# EAGLE design CMC_PREAMP (EAGLE 9.1.2)
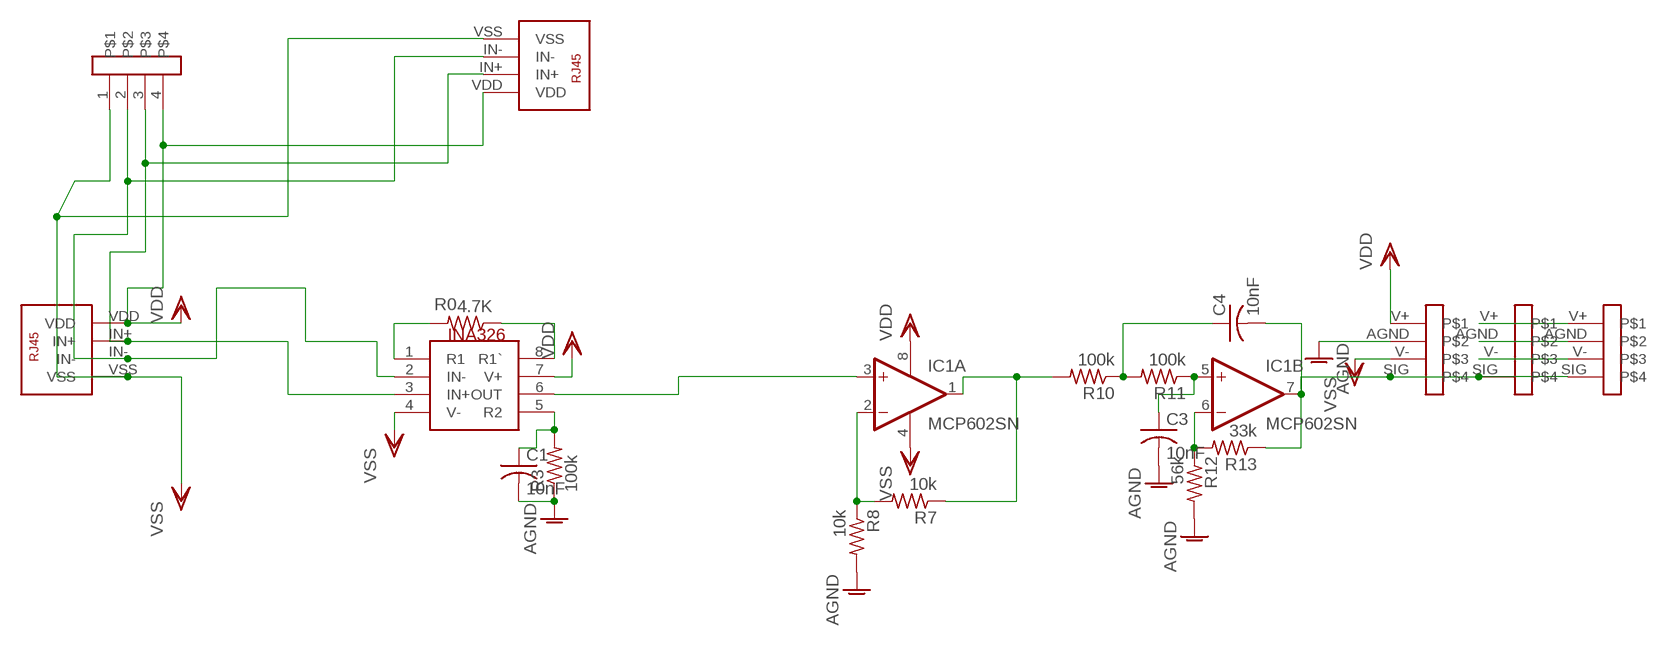
[diagram p0: schematic, sheet 1]

## Parts
C1  10nF  C-USC0603  [C0603]
C3  10nF  C-USC0603  [C0603]
C4  10nF  C-USC0603  [C0603]
IC1  MCP602SN  [SO08]
R0  4.7K  R-US_R0603  [R0603]
R3  100k  R-US_R0603  [R0603]
R7  10k  R-US_R0603  [R0603]
R8  10k  R-US_R0603  [R0603]
R10  100k  R-US_R0603  [R0603]
R11  100k  R-US_R0603  [R0603]
R12  56k  R-US_R0603  [R0603]
R13  33k  R-US_R0603  [R0603]
U$1  CON-4PIN_SILHOLE  [CON-4PIN-SIL]
U$2  CON-4PIN_SIL  [CONN-4PINSIL2]
U$3  CON-4PIN_SIL  [CONN-4PINSIL2]
U$4  RJ45-PRESSUREHOLE  [RJ45]
U$6  RJ45-PRESSUREHOLE  [RJ45]
U$7  CON-4PIN_SIL  [CONN-4PINSIL2]
U$8  INA326  [MSOP08]

## Nets
AGND: C1.2 C3.2 R3.1 R8.2 R12.2 U$7.AGND
AMP2-OUT: IC1.1(A:OUT) R7.1 R10.2
AMP-IN+: U$1.3 U$4.IN+ U$6.IN+ U$8.3(IN+)
AMP-IN-: U$1.2 U$4.IN- U$6.IN- U$8.2(IN-)
INA-OUT1: IC1.3(A:+IN) U$8.6(OUT)
LPF-OUT: C4.2 IC1.7(B:OUT) R13.1 U$2.SIG U$3.SIG U$7.SIG
N$1: R0.2 U$8.1(R1)
N$2: U$2.V+ U$3.V+
N$3: R0.1 U$8.8(R1`)
N$4: U$2.AGND U$3.AGND
N$6: U$2.V- U$3.V-
N$14: IC1.2(A:-IN) R7.2 R8.1
N$27: C4.1 R10.1 R11.2
N$28: C1.1 R3.2 U$8.5(R2)
N$32: IC1.6(B:-IN) R12.1 R13.2
N$33: C3.1 IC1.5(B:+IN) R11.1
VDD: IC1.8(P:V+) U$1.4 U$4.VDD U$6.VDD U$7.V+ U$8.7(V+)
VSS: IC1.4(P:V-) U$1.1 U$4.VSS U$6.VSS U$7.V- U$8.4(V-)

## Library data of the parts
C1 C3 C4 = rcl:C-US: CAPACITOR, American symbol
IC1 = linear:MCP602: Single Op Amp 2.7V to 6.0V Single Supply CMOS Source: http://ww1.microchip.com/downloads/en/DeviceDoc/21314g.pdf
R0 R3 R7 R8 R10-R13 = rcl:R-US_: RESISTOR, American symbol
U$1-U$3 U$7 = CMCbioengg:CON-4PIN_SIL
U$4 U$6 = CMCbioengg:RJ45-PRESSURE
U$8 = surdev_2014:INA326

## Board
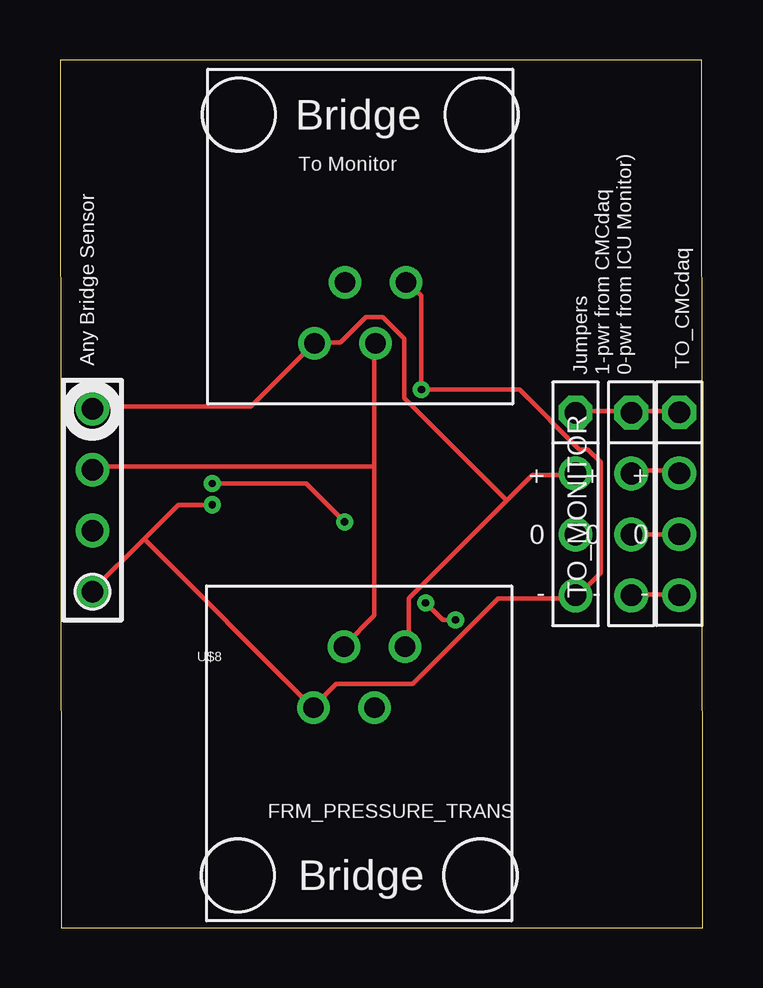
[diagram p1: board, top side]
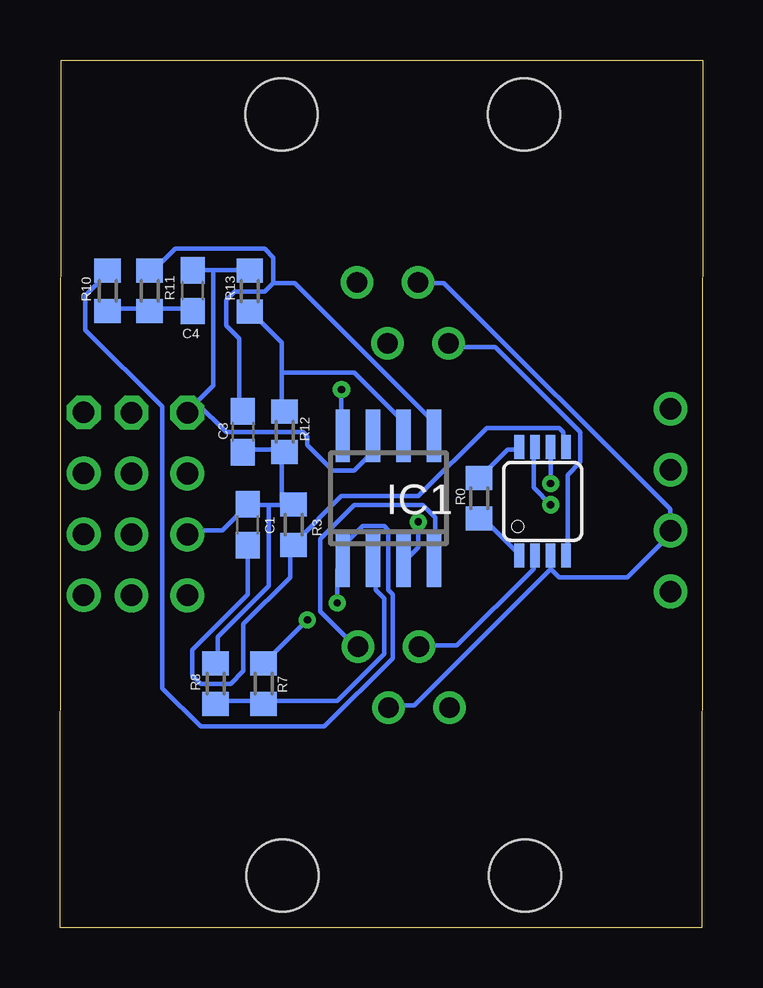
[diagram p2: board, bottom side, seen from below]

Size 26.79 x 36.18 mm. Coordinates in mm from the lower left corner, seen from the top.
Outline: 0.05,0 26.79,0 26.74,36.18 0,36.18 0.05,0
Copper layers (1*16): Top 0.035mm / dielectric 1.5mm / Bottom 0.035mm
Design rules "default *": minimum track width 7mil, minimum drill 12mil, track to track 7mil, track to pad 7mil, pad to pad 7mil, via to via 7mil, smd to smd 7mil, copper to edge 10mil, drill to drill 7mil, minimum pad ring 10mil, minimum via ring 8mil, stop-mask expansion 4mil, vias tented up to drill 0mil, thermal gap 10mil

### Footprints (pad centres in the part's own frame; a part is rotated, then mirrored left to right if it is on the bottom)
C0603 = smd 1.1 x 1: 1 -0.85,0; 2 0.85,0
SO08 = smd 0.6 x 2.2: 1 -1.905,-2.6; 2 -0.635,-2.6; 3 0.635,-2.6; 4 1.905,-2.6; 5 1.905,2.6; 6 0.635,2.6; 7 -0.635,2.6; 8 -1.905,2.6
R0603 = smd 1 x 1.1: 1 -0.85,0; 2 0.85,0
CON-4PIN-SIL = drill 0.9: 1 0,5.08; 2 0,2.54; 3 0,0; 4 0,-2.54
CONN-4PINSIL2 = drill 0.9: AGND 0,1.27; V+ 0,3.81; V- 0,-1.27 | drill 0.9 octagon: SIG 0,-3.81
RJ45 = drill 0.85: IN+ 0.635,0; IN- -0.635,2.54; VDD -1.905,0; VSS 1.905,2.54 | hole 3: 5.05,-7; -5.05,-7
MSOP08 = smd 0.4 x 1: 1 -0.976,-2.263; 2 -0.326,-2.263; 3 0.324,-2.263; 4 0.974,-2.263; 5 0.974,2.262; 6 0.324,2.262; 7 -0.326,2.262; 8 -0.976,2.262

### Placement (x,y rotation side)
C1  18.96,16.8 90 bottom
C3  19.18,20.68 270 bottom
C4  21.27,26.56 90 bottom
IC1  13.1,17.91 0 bottom
R0  9.32,17.91 270 bottom
R3  17.05,16.8 270 bottom
R7  18.3,10.18 270 bottom
R8  20.3,10.18 90 bottom
R10  24.8,26.55 90 bottom
R11  23.05,26.55 270 bottom
R12  17.43,20.68 270 bottom
R13  18.88,26.54 270 bottom
U$1  1.35,16.56 0 top
U$2  23.8,17.67 180 top
U$3  25.8,17.68 180 top
U$4  12.46,9.18 0 top
U$6  12.51,26.91 180 top
U$7  21.48,17.67 180 top
U$8  6.67,17.78 0 bottom

### Tracks (layer width: path | path; a pad name or v marks a point on that pad's centre or on a via)
AGND
  Bottom 0.178: C3.2 19.15,19.95 17.55,19.95 R12.2 17.55,19.77 17.55,17.63 | 18.08,17.63 18.79,17.63 C1.2 18.97,17.63 20.04,16.57 21.46,16.57 U$7.AGND | 18.08,17.63 17.55,17.63 | 17.55,17.63 17.19,17.63 R3.1 17.55,17.63 | 18.08,17.63 18.08,14.26 20.21,12.12 20.21,11.06 R8.2
AMP2-OUT  (via drill 0.3)
  Top 0.178: v16.48,12.83 15.95,12.83 v15.24,13.54
  Bottom 0.178: v16.48,12.83 18.26,11.06 R7.1 | v15.24,13.54 15.24,14.97 15.06,15.15 IC1.1 14.88,15.32 14.88,16.03 14.17,16.75 13.28,16.75 13.1,16.57 13.1,14.08 12.92,13.9 12.92,11.23 15.77,8.39 20.93,8.39 22.53,9.99 22.53,21.72 25.73,24.92 25.73,26.35 24.84,27.24 R10.2
AMP-IN+
  Bottom 0.178: 6.34,14.97 6.34,15.5 U$8.3 | 6.34,14.97 5.99,14.61 3.15,14.61 1.37,16.39 U$1.3 1.37,16.57 1.37,17.46 10.79,26.88 11.86,26.88 U$6.IN+ | 6.34,14.97 12.04,9.28 12.92,9.28 U$4.IN+
AMP-IN-
  Top 0.178: 13.1,19.23 13.1,13.01 11.86,11.77 U$4.IN- | 13.1,19.23 13.1,24.21 U$6.IN- | 13.1,19.23 1.37,19.23 U$1.2
  Bottom 0.178: U$8.2 7.06,15.5 7.06,14.97 10.26,11.77 11.68,11.77 U$4.IN-
INA-OUT1  (via drill 0.3)
  Top 0.178: v6.34,18.52 10.26,18.52 v11.86,16.92
  Bottom 0.178: v6.34,18.52 6.34,19.95 U$8.6 | v11.86,16.92 11.86,15.86 12.39,15.32 IC1.3
LPF-OUT
  Top 0.178: U$3.SIG 25.73,21.55 23.95,21.55 U$2.SIG 23.77,21.55 21.64,21.55 U$7.SIG
  Bottom 0.178: 20.39,27.41 21.1,27.41 C4.2 | 20.39,27.41 18.97,27.41 R13.1 | 20.39,27.41 20.39,22.61 21.1,21.9 | 21.1,21.9 21.46,21.55 U$7.SIG 21.1,21.9 | 21.1,21.9 19.86,20.66 16.66,20.66 16.48,20.48 16.48,20.12 15.41,19.06 14.52,19.06 13.81,19.77 13.81,20.48 IC1.7
N$1
  Bottom 0.178: U$8.1 7.77,15.68 9.19,17.1 R0.2
N$2
  Top 0.178: U$2.V+ 23.95,13.9 25.73,13.9 U$3.V+
N$3
  Bottom 0.178: U$8.8 7.77,19.95 8.12,19.95 9.19,18.88 R0.1
N$4
  Top 0.178: U$2.AGND 23.95,16.39 25.73,16.39 U$3.AGND
N$6
  Top 0.178: U$2.V- 23.95,19.06 25.73,19.06 U$3.V-
N$14
  Bottom 0.178: R8.1 20.21,9.46 18.44,9.46 R7.2 18.26,9.46 15.24,9.46 13.28,11.41 13.28,13.72 13.64,14.08 13.64,15.15 IC1.2
N$27
  Bottom 0.178: R10.1 24.66,25.81 23.06,25.81 R11.2 22.88,25.81 21.28,25.81 C4.1
N$28
  Bottom 0.178: U$8.5 5.81,20.12 5.81,20.66 5.99,20.83 9.01,20.83 11.86,17.99 15.06,17.99 17.01,16.03 R3.2 17.19,15.86 17.19,14.61 19.15,12.66 19.15,10.7 19.68,10.17 20.93,10.17 21.28,10.52 21.28,11.59 18.97,13.9 18.97,15.86 C1.1
N$32
  Bottom 0.178: 17.55,23.15 17.55,24.39 18.79,25.64 R13.2 | 17.55,23.15 17.55,21.55 R12.1 | 17.55,23.15 14.52,23.15 12.57,21.19 12.57,20.66 IC1.6
N$33
  Bottom 0.178: 17.9,26.88 18.26,26.52 19.5,26.52 19.86,26.17 19.86,25.1 19.32,24.57 19.32,21.55 C3.1 | 17.9,26.88 17.9,27.95 18.26,28.3 21.99,28.3 22.88,27.41 R11.1 | 17.9,26.88 17.01,26.88 11.32,21.19 11.32,20.66 IC1.5
VDD  (via drill 0.3)
  Top 0.178: U$6.VDD 14.52,26.88 15.06,26.35 v15.06,22.43 19.15,22.43 21.64,19.95 21.99,19.95 22.53,19.41 22.53,14.79 21.64,13.9 U$7.V+ 21.46,13.72 18.26,13.72 14.7,10.17 11.5,10.17 10.61,9.28 U$4.VDD 10.44,9.28 3.5,16.21 | v6.34,17.63 4.92,17.63 3.5,16.21 | 3.5,16.21 1.37,14.08 U$1.4
  Bottom 0.178: v15.06,22.43 15.06,20.66 IC1.8 | v6.34,17.63 7.06,18.35 7.06,19.95 U$8.7
VSS
  Top 0.178: U$1.1 1.37,21.72 7.94,21.72 10.44,24.21 U$6.VSS 10.61,24.39 11.68,24.39 12.75,25.46 13.46,25.46 14.35,24.57 14.35,22.08 18.61,17.81 | 18.61,17.81 14.52,13.72 14.52,11.77 U$4.VSS | 18.61,17.81 19.68,18.88 21.46,18.88 U$7.V-
  Bottom 0.178: U$8.4 5.63,15.68 5.63,18.88 5.1,19.41 5.1,20.66 8.66,24.21 10.44,24.21 U$6.VSS | IC1.4 11.15,15.32 11.15,17.1 11.68,17.63 14.52,17.63 15.95,16.21 15.95,13.19 14.52,11.77 U$4.VSS

### Text on the board
tNames: To Monitor | TO_CMCdaq | Any Bridge Sensor | Jumpers / 1-pwr from CMCdaq / 0-pwr from ICU Monitor) | TO_MONITOR | U$8 | FRM_PRESSURE_TRANS
bValues: DCamp